# Altium schematic sheet Page13 SOM Interface.SchDoc
size 411 x 246 mm
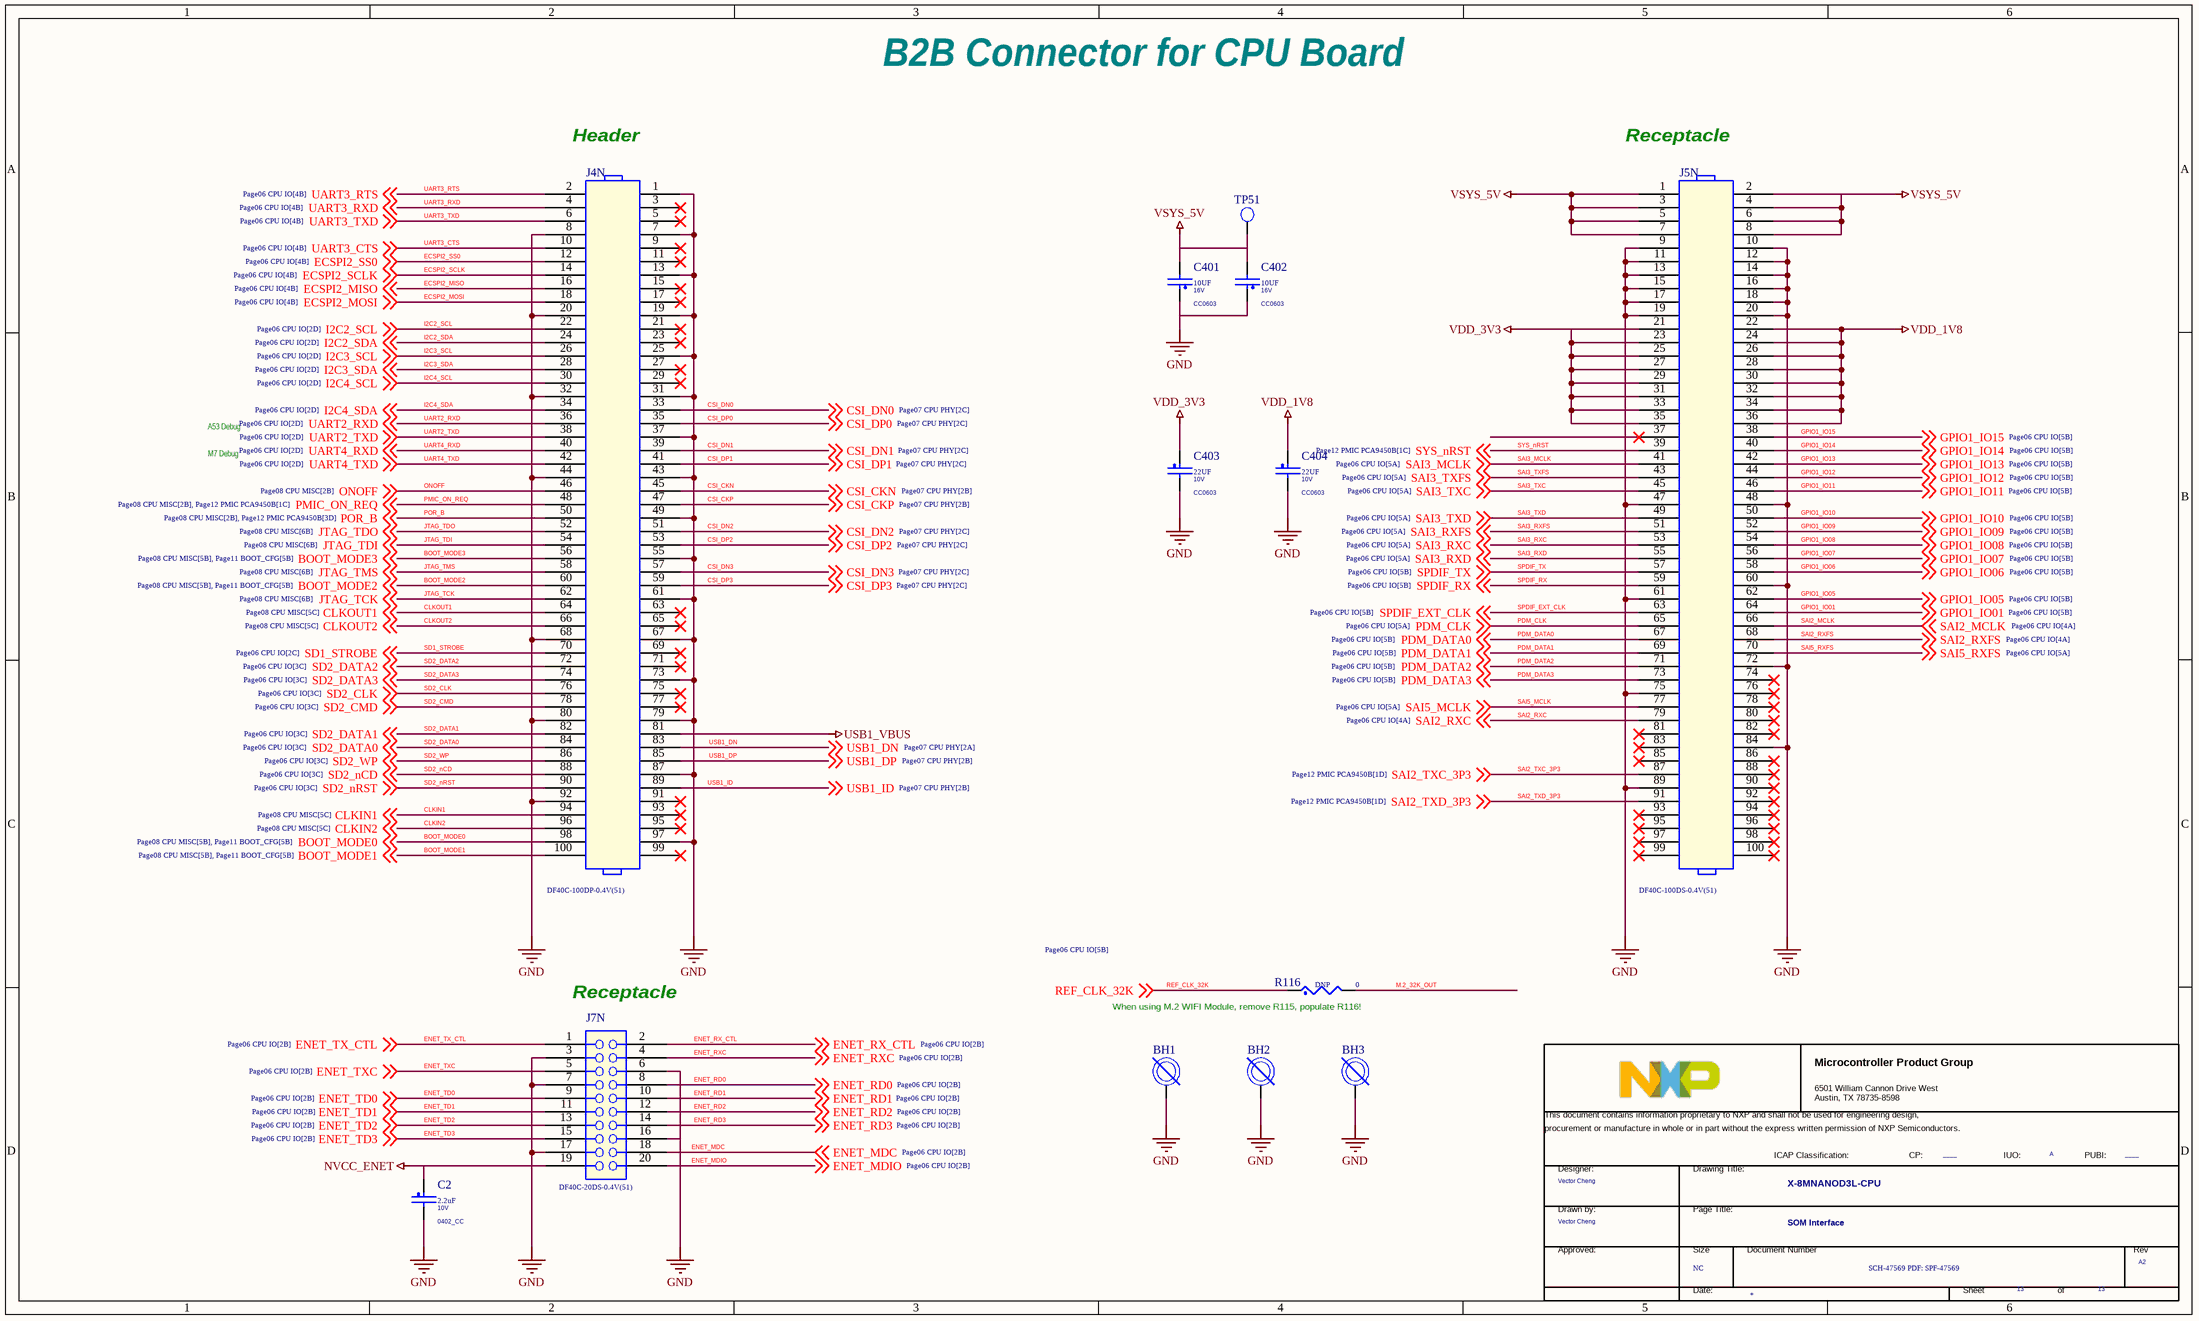
[diagram p0: Page13 SOM Interface.SchDoc]

## Parts
*  FCP: ____  FIUO: A  DrawnBy: Vector Cheng  PageTitle: SOM Interface  Page Count: 13  Page Size: NC  Title: X-8MNANOD3L-CPU  RevCode: A2  Doc: SCH-47569 PDF: SPF-47569  (hidden comment: TitleBlock_MCPG)  (graphical)
BH1  MOUNTING HOLE  [GNDPOINT256]  (value not drawn)
BH2  MOUNTING HOLE  [GNDPOINT256]  (value not drawn)
BH3  MOUNTING HOLE  [GNDPOINT256]  (value not drawn)
C2  2.2uF  VOLTAGE: 10V  PCB Footprint: 0402_CC  [0402_CC - C]
C401  10UF  PCB Footprint: CC0603  VOLTAGE: 16V  [0603_CC]
C402  10UF  PCB Footprint: CC0603  VOLTAGE: 16V  [0603_CC]
C403  22UF  PCB Footprint: CC0603  VOLTAGE: 10V  [0603_CC]
C404  22UF  PCB Footprint: CC0603  VOLTAGE: 10V  [0603_CC]
J4N  DF40C-100DP-0.4V(51)  [con100_0p4_21p7x2p05_sm]
J5N  DF40C-100DS-0.4V(51)  [con100_0p4_22p8x3p1_sm]
J7N  DF40C-20DS-0.4V(51)  [con20_0p4_6p8x3p1_sm]
R116  0  ASSY_OPT: DNP  [0402_CC_RES]
TP51  TP_35MIL  [testpoint_35mil]  (value not drawn)

## Nets
GND: BH1.1 BH2.1 BH3.1 C2.2 C401.1 C402.1 C403.2 C404.2 J4N.1 J4N.7 J4N.8 J4N.13 J4N.19 J4N.20 J4N.25 J4N.31 J4N.32 J4N.37 J4N.43 J4N.44 J4N.49 J4N.55 J4N.61 J4N.67 J4N.68 J4N.73 J4N.79 J4N.80 J4N.87 J4N.92 J4N.97 J5N.9 J5N.10 J5N.11 J5N.12 J5N.13 J5N.14 J5N.15 J5N.16 J5N.17 J5N.18 J5N.19 J5N.20 J5N.47 J5N.48 J5N.60 J5N.61 J5N.72 J5N.75 J5N.84 J5N.89 J7N.3 J7N.6 J7N.7 J7N.16 J7N.17
NVCC_ENET: C2.1 J7N.19
USB1_VBUS: J4N.81
VDD_1V8: C404.1 J5N.22 J5N.24 J5N.26 J5N.28 J5N.30 J5N.32 J5N.34 J5N.36
VDD_3V3: C403.1 J5N.21 J5N.23 J5N.25 J5N.27 J5N.29 J5N.31 J5N.33 J5N.35
VSYS_5V: C401.2 C402.2 J5N.1 J5N.2 J5N.3 J5N.4 J5N.5 J5N.6 J5N.7 J5N.8 TP51.1(TP)
BOOT_MODE0: J4N.98 ; off-sheet BOOT_MODE0
BOOT_MODE1: J4N.100 ; off-sheet BOOT_MODE1
BOOT_MODE2: J4N.60 ; off-sheet BOOT_MODE2
BOOT_MODE3: J4N.56 ; off-sheet BOOT_MODE3
CLKIN1: J4N.94 ; off-sheet CLKIN1
CLKIN2: J4N.96 ; off-sheet CLKIN2
CLKOUT1: J4N.64 ; off-sheet CLKOUT1
CLKOUT2: J4N.66 ; off-sheet CLKOUT2
CSI_CKN: J4N.45 ; off-sheet CSI_CKN
CSI_CKP: J4N.47 ; off-sheet CSI_CKP
CSI_DN0: J4N.33 ; off-sheet CSI_DN0
CSI_DN1: J4N.39 ; off-sheet CSI_DN1
CSI_DN2: J4N.51 ; off-sheet CSI_DN2
CSI_DN3: J4N.57 ; off-sheet CSI_DN3
CSI_DP0: J4N.35 ; off-sheet CSI_DP0
CSI_DP1: J4N.41 ; off-sheet CSI_DP1
CSI_DP2: J4N.53 ; off-sheet CSI_DP2
CSI_DP3: J4N.59 ; off-sheet CSI_DP3
ECSPI2_MISO: J4N.16 ; off-sheet ECSPI2_MISO
ECSPI2_MOSI: J4N.18 ; off-sheet ECSPI2_MOSI
ECSPI2_SCLK: J4N.14 ; off-sheet ECSPI2_SCLK
ECSPI2_SS0: J4N.12 ; off-sheet ECSPI2_SS0
ENET_MDC: J7N.18 ; off-sheet ENET_MDC
ENET_MDIO: J7N.20 ; off-sheet ENET_MDIO
ENET_RD0: J7N.8 ; off-sheet ENET_RD0
ENET_RD1: J7N.10 ; off-sheet ENET_RD1
ENET_RD2: J7N.12 ; off-sheet ENET_RD2
ENET_RD3: J7N.14 ; off-sheet ENET_RD3
ENET_RX_CTL: J7N.2 ; off-sheet ENET_RX_CTL
ENET_RXC: J7N.4 ; off-sheet ENET_RXC
ENET_TD0: J7N.9 ; off-sheet ENET_TD0
ENET_TD1: J7N.11 ; off-sheet ENET_TD1
ENET_TD2: J7N.13 ; off-sheet ENET_TD2
ENET_TD3: J7N.15 ; off-sheet ENET_TD3
ENET_TX_CTL: J7N.1 ; off-sheet ENET_TX_CTL
ENET_TXC: J7N.5 ; off-sheet ENET_TXC
GPIO1_IO01: J5N.64 ; off-sheet GPIO1_IO01
GPIO1_IO05: J5N.62 ; off-sheet GPIO1_IO05
GPIO1_IO06: J5N.58 ; off-sheet GPIO1_IO06
GPIO1_IO07: J5N.56 ; off-sheet GPIO1_IO07
GPIO1_IO08: J5N.54 ; off-sheet GPIO1_IO08
GPIO1_IO09: J5N.52 ; off-sheet GPIO1_IO09
GPIO1_IO10: J5N.50 ; off-sheet GPIO1_IO10
GPIO1_IO11: J5N.46 ; off-sheet GPIO1_IO11
GPIO1_IO12: J5N.44 ; off-sheet GPIO1_IO12
GPIO1_IO13: J5N.42 ; off-sheet GPIO1_IO13
GPIO1_IO14: J5N.40 ; off-sheet GPIO1_IO14
GPIO1_IO15: J5N.38 ; off-sheet GPIO1_IO15
I2C2_SCL: J4N.22 ; off-sheet I2C2_SCL
I2C2_SDA: J4N.24 ; off-sheet I2C2_SDA
I2C3_SCL: J4N.26 ; off-sheet I2C3_SCL
I2C3_SDA: J4N.28 ; off-sheet I2C3_SDA
I2C4_SCL: J4N.30 ; off-sheet I2C4_SCL
I2C4_SDA: J4N.34 ; off-sheet I2C4_SDA
JTAG_TCK: J4N.62 ; off-sheet JTAG_TCK
JTAG_TDI: J4N.54 ; off-sheet JTAG_TDI
JTAG_TDO: J4N.52 ; off-sheet JTAG_TDO
JTAG_TMS: J4N.58 ; off-sheet JTAG_TMS
M.2_32K_OUT: R116.2
ONOFF: J4N.46 ; off-sheet ONOFF
PDM_CLK: J5N.65 ; off-sheet PDM_CLK
PDM_DATA0: J5N.67 ; off-sheet PDM_DATA0
PDM_DATA1: J5N.69 ; off-sheet PDM_DATA1
PDM_DATA2: J5N.71 ; off-sheet PDM_DATA2
PDM_DATA3: J5N.73 ; off-sheet PDM_DATA3
PMIC_ON_REQ: J4N.48 ; off-sheet PMIC_ON_REQ
POR_B: J4N.50 ; off-sheet POR_B
REF_CLK_32K: R116.1 ; off-sheet REF_CLK_32K
SAI2_MCLK: J5N.66 ; off-sheet SAI2_MCLK
SAI2_RXC: J5N.79 ; off-sheet SAI2_RXC
SAI2_RXFS: J5N.68 ; off-sheet SAI2_RXFS
SAI2_TXC_3P3: J5N.87 ; off-sheet SAI2_TXC_3P3
SAI2_TXD_3P3: J5N.91 ; off-sheet SAI2_TXD_3P3
SAI3_MCLK: J5N.41 ; off-sheet SAI3_MCLK
SAI3_RXC: J5N.53 ; off-sheet SAI3_RXC
SAI3_RXD: J5N.55 ; off-sheet SAI3_RXD
SAI3_RXFS: J5N.51 ; off-sheet SAI3_RXFS
SAI3_TXC: J5N.45 ; off-sheet SAI3_TXC
SAI3_TXD: J5N.49 ; off-sheet SAI3_TXD
SAI3_TXFS: J5N.43 ; off-sheet SAI3_TXFS
SAI5_MCLK: J5N.77 ; off-sheet SAI5_MCLK
SAI5_RXFS: J5N.70 ; off-sheet SAI5_RXFS
SD1_STROBE: J4N.70 ; off-sheet SD1_STROBE
SD2_CLK: J4N.76 ; off-sheet SD2_CLK
SD2_CMD: J4N.78 ; off-sheet SD2_CMD
SD2_DATA0: J4N.84 ; off-sheet SD2_DATA0
SD2_DATA1: J4N.82 ; off-sheet SD2_DATA1
SD2_DATA2: J4N.72 ; off-sheet SD2_DATA2
SD2_DATA3: J4N.74 ; off-sheet SD2_DATA3
SD2_nCD: J4N.88 ; off-sheet SD2_nCD
SD2_nRST: J4N.90 ; off-sheet SD2_nRST
SD2_WP: J4N.86 ; off-sheet SD2_WP
SPDIF_EXT_CLK: J5N.63 ; off-sheet SPDIF_EXT_CLK
SPDIF_RX: J5N.59 ; off-sheet SPDIF_RX
SPDIF_TX: J5N.57 ; off-sheet SPDIF_TX
SYS_nRST: J5N.39 ; off-sheet SYS_nRST
UART2_RXD: J4N.36 ; off-sheet UART2_RXD
UART2_TXD: J4N.38 ; off-sheet UART2_TXD
UART3_CTS: J4N.10 ; off-sheet UART3_CTS
UART3_RTS: J4N.2 ; off-sheet UART3_RTS
UART3_RXD: J4N.4 ; off-sheet UART3_RXD
UART3_TXD: J4N.6 ; off-sheet UART3_TXD
UART4_RXD: J4N.40 ; off-sheet UART4_RXD
UART4_TXD: J4N.42 ; off-sheet UART4_TXD
USB1_DN: J4N.83 ; off-sheet USB1_DN
USB1_DP: J4N.85 ; off-sheet USB1_DP
USB1_ID: J4N.89 ; off-sheet USB1_ID

Not connected (* = marked no-connect by the designer): J4N 3* 5* 9* 11* 15* 17* 21* 23* 27* 29* 63* 65* 69* 71* 75* 77* 91* 93* 95* 99*; J5N 37* 74* 76* 78* 80* 81* 82* 83* 85* 86* 88* 90* 92* 93* 94* 95* 96* 97* 98* 99* 100*

## Notes on the sheet
- B2B Connector for CPU Board
- (near J4N) Header
- (near J5N) Receptacle
- A53 Debug
- M7 Debug
- (near J7N) Receptacle
- (near R116) When using M.2 WIFI Module, remove R115, populate R116!
- (in symbol TitleBlock_MCPG) Microcontroller Product Group; 6501 William Cannon Drive West / Austin, TX 78735-8598; This document contains information proprietary to NXP and shall not be used for engineering design,; procurement or manufacture in whole or in part without the express written permission of NXP Semiconductors.; ICAP Classification:; CP:; IUO:; PUBI:; Designer:; Drawing Title:; Drawn by:; Page Title:; Approved:; Size; Document Number; Rev; Date:; Sheet; of

## Library data of the parts
* = TitleBlock_MCPG: OrgName: NXP Semiconductor; OrgAddr1: NO. 192 Liangjing Rd. Pudong New Area, ShangHai; PUBI: ____; Designer: Vector Cheng; Page Number: 13; Page Create Date: March  8, 1995; Page Modify Date: *
BH1 = MOUNT_HOLE: MOUNTING HOLE DRILL 109 PAD 200 PLATED TH NO PART TO ORDER; CLASS: IC; CAD_APPROVED: Yes; ASSY_OPT: DNP; AGILE_PN: 280-75147; HEIGHT: 0.005 MILS; ROHS: Yes; PCB Footprint: GNDPOINT256
BH2 BH3 = MOUNT_HOLE: MOUNTING HOLE DRILL 109 PAD 200 PLATED TH NO PART TO ORDER; CLASS: IC; AGILE_PN: 280-75147; ASSY_OPT: DNP; CAD_APPROVED: Yes; ROHS: Yes; HEIGHT: 0.005 MILS; PCB Footprint: GNDPOINT256
C2 = CAP_NP: CAP CER 2.2uF 10V 10% X5R 0402; CLASS: DISCRETE; AGILE_PN: 150-78974; MFG_NAME01: TDK; MFG_PN01: C1005X5R1A225K; CAD_APPROVED: Yes; FPLIST: CC0402_25,CC0402_HD,0402_CC; Package Size: 0402; Tolerance: 10%; ROHS: Yes; HEIGHT: 0.55 MM
C401 = CAP_NP: CAP CER 10.0uF 16V 10% X5R 0603; CLASS: DISCRETE; Temp Range: -55¡ãC to +85¡ãC; AGILE_PN: 150-80060; MFG_NAME01: MURATA; MFG_PN01: GRM188R61C106KAALD; CAD_APPROVED: Yes; FPLIST: CC0603_OV,CC0603,0603_CC,cc0603_0805_nsp; Package Type: SMT; Package Size: 0603; Tolerance: 10%; ROHS: Yes; Temp_Range: -55¡ãC to +85¡ãC; HEIGHT: 0.9MM
C402 = CAP_NP: CAP CER 10.0uF 16V 10% X5R 0603; CLASS: DISCRETE; Temp Range: -55¡ãC to +85¡ãC; FPLIST: CC0603_OV,CC0603,0603_CC,cc0603_0805_nsp; CAD_APPROVED: Yes; MFG_PN01: GRM188R61C106KAALD; MFG_NAME01: MURATA; AGILE_PN: 150-80060; Package Type: SMT; Package Size: 0603; HEIGHT: 0.9MM; Temp_Range: -55¡ãC to +85¡ãC; ROHS: Yes; Tolerance: 10%
C403 C404 = CAP_NP: CAP CER 22uF 10V 20% X5R 0603; CLASS: DISCRETE; WVDC: 6.3V; AGILE_PN: 150-79530; MFG_NAME01: TDK; MFG_PN01: C1608X5R1A226M080AC; CAD_APPROVED: Yes; FPLIST: CC0603_OV,CC0603,0603_CC; SIGNAL_MODEL: DEFAULT_CAPACITOR_2.2e+07pF_2_1; Package Size: 0603; Tolerance: 20%; ROHS: Yes; HEIGHT: 1MM
J4N = HDR_2X50_M: CON 2X50 PLUG SHRD SMT 0.4MM SP 51H AU; CLASS: IO; Temp Range: -35 to 85 &#8451;; CAD_APPROVED: Yes; MFG_NAME01: HIROSE; AGILE_PN: 211-80305; HEIGHT: 1.29MM; Temp_Range: -35 to 85 &#8451;; ROHS: Yes; MFG_PN01: DF40C-100DP-0.4V(51); PCB Footprint: con100_0p4_21p7x2p05_sm
J5N = HDR_2X50_M: CON 2X50 SKT SHRD SMT 0.4MM SP 65H AU; CLASS: IO; Temp Range: -35C to +85C; AGILE_PN: 211-80183; MFG_NAME01: HIROSE; CAD_APPROVED: Yes; Package Type: SMT; MFG_PN01: DF40C-100DS-0.4V(51); ROHS: Yes; Temp_Range: -35C to +85C; HEIGHT: 1.65 MM; PCB Footprint: con100_0p4_22p8x3p1_sm
J7N = CONN_HDR_10X2: CON 2X10 SKT SHRD SMT 0.4MM SP 63H AU; CLASS: IO; Temp Range: -35C to 85C; CAD_APPROVED: Yes; MFG_NAME01: HIROSE; AGILE_PN: 211-80328; PCB Footprint: con20_0p4_6p8x3p1_sm; HEIGHT: 1.6MM; Temp_Range: -35C to 85C; ROHS: Yes; MFG_PN01: DF40C-20DS-0.4V(51)
R116 = RES: RES MF ZERO OHM 1/16W 5% 0402; CLASS: DISCRETE; AGILE_PN: 470-75394; MFG_NAME01: YAGEO AMERICA; MFG_PN01: RC0402JR-070RL; CAD_APPROVED: Yes; PCB Footprint: 0402_CC; VOLTAGE: 1/16W; Tolerance: 5%; ROHS: Yes; HEIGHT: 0.45 MM
TP51 = T POINT R: TEST POINT PAD .035 SMT, no part to order; ASSY_OPT: DNP; CLASS: IC; AGILE_PN: 510-75618; CAD_APPROVED: Yes; PCB Footprint: testpoint_35mil; ROHS: Yes; HEIGHT: 0.1MM